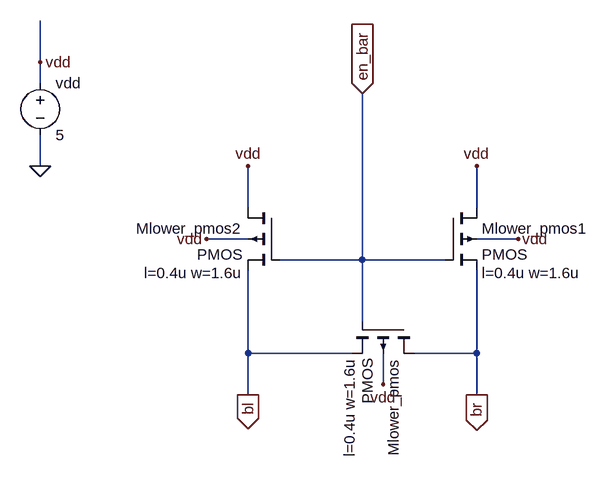
[diagram p0: schematic sram_16x2_precharge_0.asc]
sram_16x2_precharge_0.asc, the LTspice schematic file:
Version 4
SHEET 1 880 680
WIRE -448 -64 -448 -128
WIRE -448 -32 -448 -64
WIRE -448 96 -448 48
WIRE -128 160 -128 96
WIRE 224 160 224 96
WIRE -128 208 -192 208
WIRE 288 208 224 208
WIRE 48 240 48 -16
WIRE 48 240 -80 240
WIRE 176 240 48 240
WIRE 48 336 48 240
WIRE -128 384 -128 256
WIRE 32 384 -128 384
WIRE 224 384 224 256
WIRE 224 384 128 384
WIRE 80 432 80 384
WIRE -128 448 -128 384
WIRE 224 448 224 384
FLAG -448 96 0
FLAG 288 208 vdd
FLAG -192 208 vdd
FLAG 80 432 vdd
FLAG 224 96 vdd
FLAG -128 96 vdd
FLAG -128 448 bl
IOPIN -128 448 Out
FLAG 224 448 br
IOPIN 224 448 Out
FLAG 48 -16 en_bar
IOPIN 48 -16 In
FLAG -448 -64 vdd
SYMBOL pmos4 128 336 R90
WINDOW 123 56 100 Left 2
SYMATTR InstName Mlower_pmos
SYMATTR Value2 l=0.4u w=1.6u
SYMBOL pmos4 176 160 R0
WINDOW 123 56 100 Left 2
SYMATTR InstName Mlower_pmos1
SYMATTR Value2 l=0.4u w=1.6u
SYMBOL pmos4 -80 160 M0
WINDOW 123 56 100 Left 2
SYMATTR InstName Mlower_pmos2
SYMATTR Value2 l=0.4u w=1.6u
SYMBOL voltage -448 -48 R0
SYMATTR InstName vdd
SYMATTR Value 5

The netlist it stands for:
* sram_16x2_precharge_0.asc
Mlower_pmos br en_bar bl vdd PMOS l=0.4u w=1.6u
Mlower_pmos1 vdd en_bar br vdd PMOS l=0.4u w=1.6u
Mlower_pmos2 vdd en_bar bl vdd PMOS l=0.4u w=1.6u
vdd vdd 0 5
.model NMOS NMOS
.model PMOS PMOS
.lib standard.mos
.backanno
.end